# EAGLE schematic Bluetooth_testr (EAGLE 9.1.0)
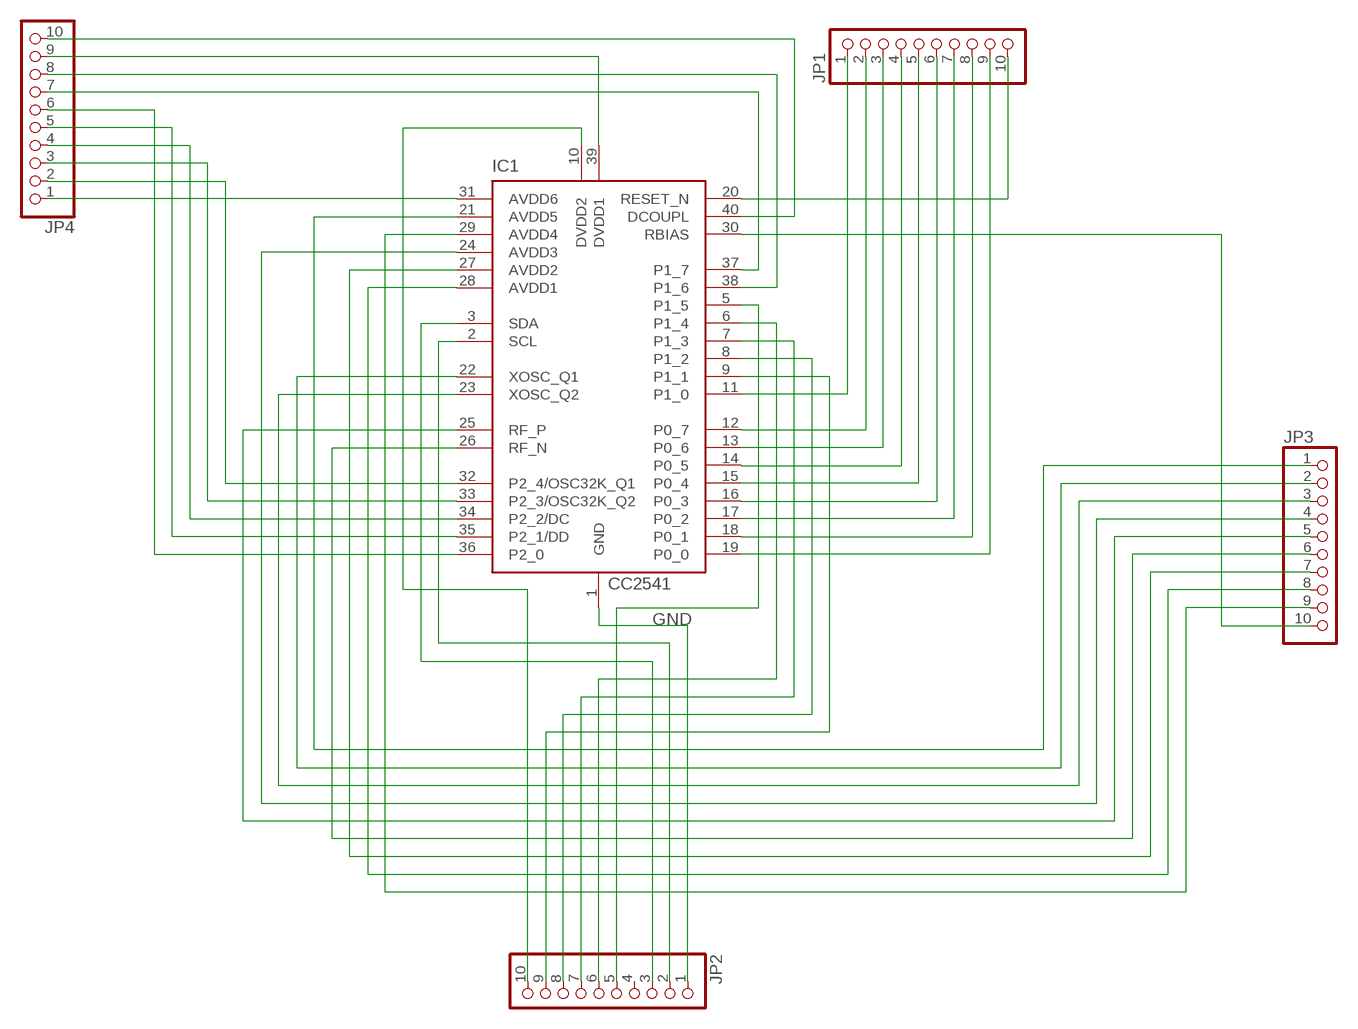
[diagram p0: schematic, sheet 1]

## Parts
IC1  CC2541  [QFN40-6X6]
JP1  PINHD-1X10  [1X10]
JP2  PINHD-1X10  [1X10]
JP3  PINHD-1X10  [1X10]
JP4  PINHD-1X10  [1X10]

## Nets
GND: IC1.1(GND) JP2.1
N$2: IC1.2(SCL) JP2.2
N$3: IC1.3(SDA) JP2.3
N$4: IC1.5(P1_5) JP2.5
N$5: IC1.6(P1_4) JP2.6
N$6: IC1.7(P1_3) JP2.7
N$7: IC1.8(P1_2) JP2.8
N$8: IC1.9(P1_1) JP2.9
N$9: IC1.10(DVDD2) JP2.10
N$10: IC1.11(P1_0) JP1.1
N$11: IC1.12(P0_7) JP1.2
N$12: IC1.13(P0_6) JP1.3
N$13: IC1.14(P0_5) JP1.4
N$14: IC1.15(P0_4) JP1.5
N$15: IC1.16(P0_3) JP1.6
N$16: IC1.17(P0_2) JP1.7
N$17: IC1.18(P0_1) JP1.8
N$18: IC1.19(P0_0) JP1.9
N$19: IC1.26(RF_N) JP3.6
N$20: IC1.21(AVDD5) JP3.1
N$21: IC1.22(XOSC_Q1) JP3.2
N$22: IC1.23(XOSC_Q2) JP3.3
N$23: IC1.24(AVDD3) JP3.4
N$24: IC1.25(RF_P) JP3.5
N$25: IC1.20(RESET_N) JP1.10
N$26: IC1.27(AVDD2) JP3.7
N$27: IC1.28(AVDD1) JP3.8
N$28: IC1.29(AVDD4) JP3.9
N$29: IC1.30(RBIAS) JP3.10
N$30: IC1.31(AVDD6) JP4.1
N$31: IC1.32(P2_4/OSC32K_Q1) JP4.2
N$32: IC1.33(P2_3/OSC32K_Q2) JP4.3
N$33: IC1.34(P2_2/DC) JP4.4
N$34: IC1.35(P2_1/DD) JP4.5
N$35: IC1.36(P2_0) JP4.6
N$36: IC1.37(P1_7) JP4.7
N$37: IC1.38(P1_6) JP4.8
N$38: IC1.39(DVDD1) JP4.9
N$39: IC1.40(DCOUPL) JP4.10
Unconnected: JP2.4

## Library data of the parts
IC1 = texas-cc2541:CC2541: The CC2541 is a power-optimized true system-on-chip (SoC) solution for both Bluetooth low energy and proprietary 2.4-GHz applications. It enables robust network nodes to be built with low total bill-of-material costs. The CC2541 combines the excellent performance of a leading RF transceiver with an industry-standard enhanced 8051 MCU, in-system programmable flash memory, 8-KB RAM, and many other powerful supporting features and peripherals. The library has been designed by Richard Magdycz <https://www.facebook.com/groups/eaglecadsoftUK>
JP1-JP4 = pinhead:PINHD-1X10: PIN HEADER